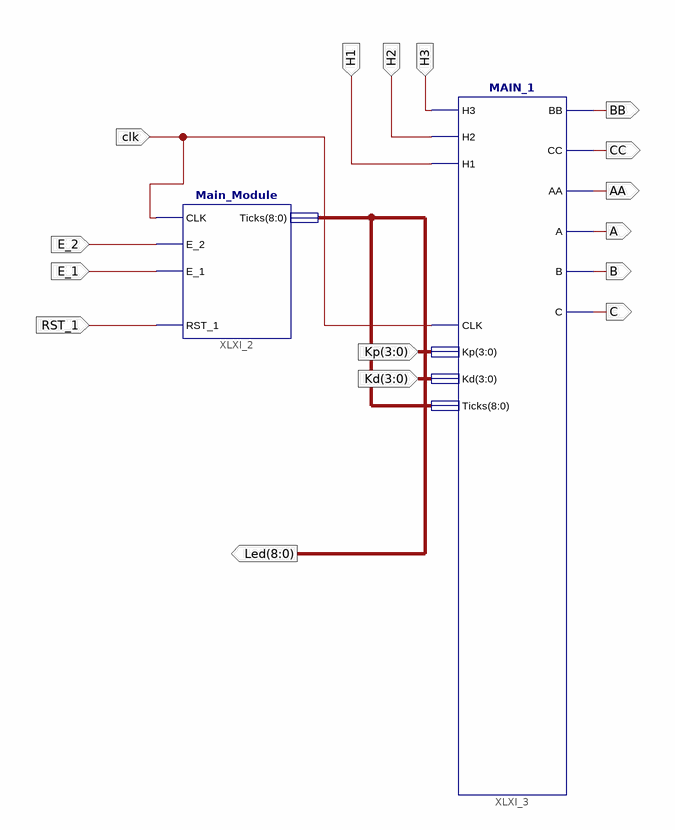
[diagram p0: schematic sheet 1]
// Xilinx ISE schematic Complete.sch (spartan3e) as structural Verilog: 2 symbols, 16 ports
module Complete (
  input  clk,
  input  E_2,
  input  E_1,
  input  RST_1,
  input  H3,
  input  H2,
  input  H1,
  input  [3:0] Kp,
  input  [3:0] Kd,
  output [8:0] Led,
  output BB,
  output CC,
  output AA,
  output A,
  output B,
  output C
);

  Main_Module XLXI_2 (.CLK(clk), .E_2(E_2), .E_1(E_1), .RST_1(RST_1), .Ticks(Led));
  MAIN_1 XLXI_3 (
    .H3(H3), .H2(H2), .H1(H1), .CLK(clk), .Kp(Kp), .Kd(Kd), .Ticks(Led), .A(A), .AA(AA), .B(B), .BB(BB),
    .C(C), .CC(CC));
endmodule
